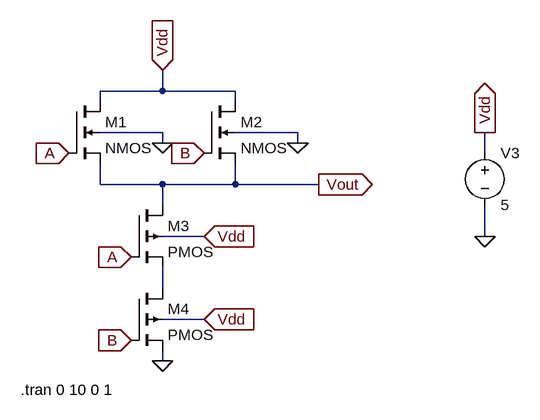
[diagram p0: schematic OR_gate (2).asc]
OR_gate (2).asc, the LTspice schematic file:
Version 4
SHEET 1 1248 680
WIRE 256 -16 256 -48
WIRE 256 -16 160 -16
WIRE 368 -16 256 -16
WIRE 160 0 160 -16
WIRE 368 0 368 -16
WIRE 256 48 160 48
WIRE 464 48 368 48
WIRE 256 64 256 48
WIRE 464 64 464 48
WIRE 752 80 752 48
WIRE 160 128 160 96
WIRE 256 128 160 128
WIRE 368 128 368 96
WIRE 368 128 256 128
WIRE 496 128 368 128
WIRE 256 160 256 128
WIRE 320 208 256 208
WIRE 752 208 752 160
WIRE 256 288 256 256
WIRE 320 336 256 336
WIRE 256 400 256 384
FLAG 256 -48 Vdd
IOPIN 256 -48 In
FLAG 256 64 0
FLAG 464 64 0
FLAG 256 400 0
FLAG 112 80 A
IOPIN 112 80 In
FLAG 208 240 A
IOPIN 208 240 In
FLAG 320 80 B
IOPIN 320 80 In
FLAG 208 368 B
IOPIN 208 368 In
FLAG 320 208 Vdd
IOPIN 320 208 In
FLAG 320 336 Vdd
IOPIN 320 336 In
FLAG 496 128 Vout
IOPIN 496 128 Out
FLAG 752 208 0
FLAG 752 48 Vdd
IOPIN 752 48 Out
SYMBOL nmos4 112 0 R0
SYMATTR InstName M1
SYMBOL nmos4 320 0 R0
SYMATTR InstName M2
SYMBOL pmos4 208 160 R0
SYMATTR InstName M3
SYMBOL pmos4 208 288 R0
SYMATTR InstName M4
SYMBOL voltage 752 64 R0
WINDOW 123 0 0 Left 0
WINDOW 39 0 0 Left 0
SYMATTR InstName V3
SYMATTR Value 5
TEXT 38 444 Left 2 !.tran 0 10 0 1

The netlist it stands for:
* OR_gate (2).asc
M1 Vdd A Vout 0 NMOS
M2 Vdd B Vout 0 NMOS
M3 Vout A N001 Vdd PMOS
M4 N001 B 0 Vdd PMOS
V3 Vdd 0 5
.model NMOS NMOS
.model PMOS PMOS
.lib standard.mos
.tran 0 10 0 1
.backanno
.end